# Altium schematic sheet Control.SchDoc
size B; DocumentNumber: 5; SheetNumber: 5; SheetTotal: 13
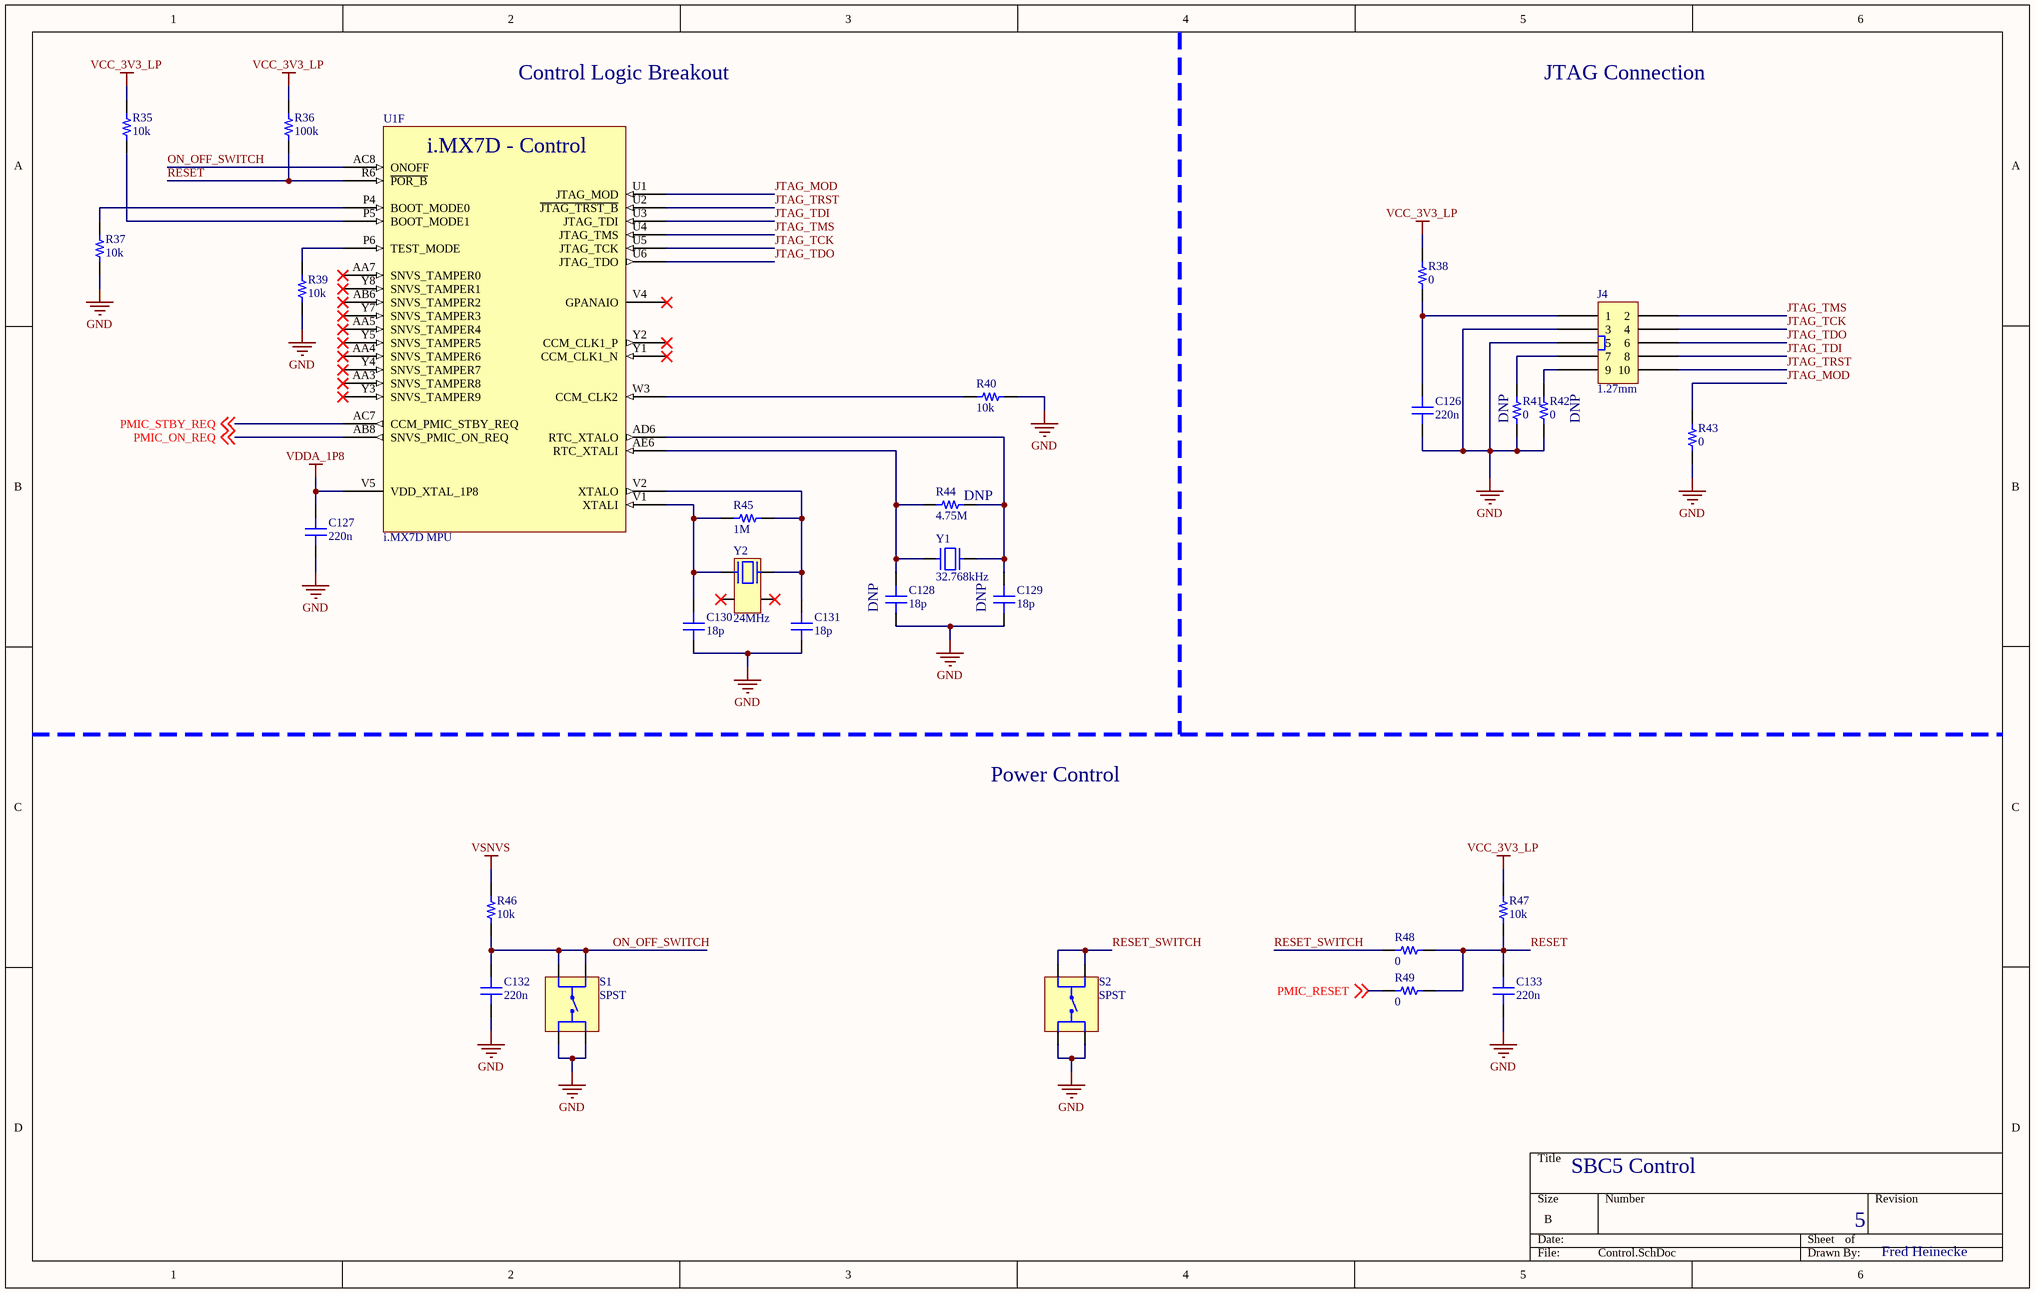
[diagram p0: Control.SchDoc]

## Parts
C126  220n  [C0201]
C127  220n  [C0201]
C128  18p  [C0402]
C129  18p  [C0402]
C130  18p  [C0402]
C131  18p  [C0402]
C132  220n  [C0201]
C133  220n  [C0201]
J4  1.27mm  [20021521-00010T1LF]
R35  10k  [R0201]
R36  100k  [R0201]
R37  10k  [R0201]
R38  0  [R1210]
R39  10k  [R0201]
R40  10k  [R0201]
R41  0  [R0402]
R42  0  [R0402]
R43  0  [R0402]
R44  4.75M  [R0402]
R45  1M  [R0402]
R46  10k  [R0201]
R47  10k  [R0201]
R48  0  [R0402]
R49  0  [R0402]
S1  SPST  [1825910-7]
S2  SPST  [1825910-7]
U1  i.MX7D MPU  [BGA541C75P25X25_1900X1900X140]  (part F of 23)
Y1  32.768kHz  [CM7V-T1A]
Y2  24MHz  [FQ5032B]

## Nets
GND: C126.1 C127.1 C128.1 C129.1 C130.1 C131.1 C132.1 C133.1 J4.3 J4.5 R37.1 R39.1 R40.2 R41.1 R42.1 R43.1 S1.3 S1.4 S2.3 S2.4
VCC_3V3_LP: R35.2 R36.2 R38.2 R47.2
VDDA_1P8: C127.2 U1.V5(VDD_XTAL_1P8)
VSNVS: R46.2
JTAG_MOD: R43.2 U1.U1(JTAG_MOD)
JTAG_TCK: J4.4 U1.U5(JTAG_TCK)
JTAG_TDI: J4.8 U1.U3(JTAG_TDI)
JTAG_TDO: J4.6 U1.U6(JTAG_TDO)
JTAG_TMS: J4.2 U1.U4(JTAG_TMS)
JTAG_TRST: J4.10 U1.U2(~{JTAG_TRST_B})
ON_OFF_SWITCH: C132.2 R46.1 S1.1 S1.2 U1.AC8(ONOFF)
PMIC_ON_REQ: U1.AB8(SNVS_PMIC_ON_REQ) ; off-sheet PMIC_ON_REQ
PMIC_RESET: R49.1 ; off-sheet PMIC_RESET
PMIC_STBY_REQ: U1.AC7(CCM_PMIC_STBY_REQ) ; off-sheet PMIC_STBY_REQ
RESET: C133.2 R36.1 R47.1 R48.2 R49.2 U1.R6(~{POR_B})
RESET_SWITCH: R48.1 S2.1 S2.2
NetC126_2: C126.2 J4.1 R38.1
NetC128_2: C128.2 R44.1 U1.AE6(RTC_XTALI) Y1.1
NetC129_2: C129.2 R44.2 U1.AD6(RTC_XTALO) Y1.2
NetC130_2: C130.2 R45.1 U1.V1(XTALI) Y2.1
NetC131_2: C131.2 R45.2 U1.V2(XTALO) Y2.3
NetJ4_7: J4.7 R41.2
NetJ4_9: J4.9 R42.2
NetR35_1: R35.1 U1.P5(BOOT_MODE1)
NetR37_2: R37.2 U1.P4(BOOT_MODE0)
NetR39_2: R39.2 U1.P6(TEST_MODE)
NetR40_1: R40.1 U1.W3(CCM_CLK2)

Not connected (* = marked no-connect by the designer): U1 AA3(SNVS_TAMPER8)* AA4(SNVS_TAMPER6)* AA5(SNVS_TAMPER4)* AA7(SNVS_TAMPER0)* AB6(SNVS_TAMPER2)* V4(GPANAIO)* Y1(CCM_CLK1_N)* Y2(CCM_CLK1_P)* Y3(SNVS_TAMPER9)* Y4(SNVS_TAMPER7)* Y5(SNVS_TAMPER5)* Y7(SNVS_TAMPER3)* Y8(SNVS_TAMPER1)*; Y2 2* 4*

## Notes on the sheet
- Control Logic Breakout
- JTAG Connection
- (near R41) DNP
- DNP
- (near R44) DNP
- (near C128) DNP
- (near C129) DNP
- Power Control
- SBC5 Control
- 5
- Fred Heinecke
- (in symbol MCIMX7D2DVM12SD, part F) i.MX7D - Control

## Library data of the parts
C126 C127 C132 C133 = GRM033R61C224KE14D: Cap Ceramic Monolithic 0.22uF 16VDC 10% SMD Paper T/R; Manufacturer: Murata; Supplier 1: Digi-Key; Manufacturer Part Number: GRM033R61C224KE14D; RoHS: No; Stock 1: 16192; Pricing 1: 1=0.10000, 10=0.03900, 50=0.02120, 100=0.01720, 500=0.01232, 1000=0.00968, 2500=0.00880, 5000=0.00810 (USD); ComponentLink1URL: https://search.murata.co.jp/Ceramy/image/img/A01X/G101/ENG/GRM033R61C224KE14-01.pdf?src-supplier=Digi-Key; ComponentLink1Description: https://search.murata.co.jp/Ceramy/image/img/A01X/G101/ENG/GRM033R61C224KE14-01.pdf?src-supplier=Digi-Key; Supplier Part Number 1: 490-17040-1-ND
C128-C131 = CL05C180JB5NNNC: CAP CER 18PF 50V C0G/NP0 0402; Manufacturer: Samsung; Material: Ceramic; Dielectric: C0G; Tolerance: 5%; Temperature Coefficient: 300ppm/°C; Supplier 1: Digi-Key; Supplier Part Number 1: 1276-1140-1-ND; Manufacturer Part Number: CL05C180JB5NNNC; RoHS: Yes; Category: Ceramic Capacitors; Stock 1: 647155; Pricing 1: 1=0.10000, 10=0.03600, 50=0.01940, 100=0.01590, 500=0.01136, 1000=0.00892, 2500=0.00811, 5000=0.00746 (USD); Mount: Surface Mount; Case/Package: 0402; Case Code (Imperial): 0402; Case Code (Metric): 1005; Contact Plating: Tin; Min Operating Temperature: -55°C; Max Operating Temperature: 125°C; Capacitance: 18pF; Voltage: 50V; Package Quantity: 1; Packaging: Tape and Reel; Voltage Rating: 50V; Length: 1mm; Width: 0.02inch; Height: 0.5mm; Thickness: 0.022inch; Depth: 0.5mm; Radiation Hardening: No; ComponentLink1URL: https://datasheet.ciiva.com/15195/getdatasheetpartid-482699-15195673.pdf?src-supplier=Verical; ComponentLink1Description: https://datasheet.ciiva.com/15195/getdatasheetpartid-482699-15195673.pdf?src-supplier=Verical; ComponentLink2URL: https://datasheet.ciiva.com/29198/458675-da-01-en-vs-kondensator-0402-29198417.pdf?src-supplier=Conrad; ComponentLink2Description: https://datasheet.ciiva.com/29198/458675-da-01-en-vs-kondensator-0402-29198417.pdf?src-supplier=Conrad; ComponentLink3URL: https://datasheet.ciiva.com/26309/mlcc-catalogdownload2013-eng-26309006.pdf?src-supplier=Distrelec; ComponentLink3Description: https://datasheet.ciiva.com/26309/mlcc-catalogdownload2013-eng-26309006.pdf?src-supplier=Distrelec
J4 = 20021521-00010T1LF: CONN HEADER SMD 10POS 1.27MM; Manufacturer: Amphenol FCI; Number of Positions: 10; Connector Type: Male Pin; Current Rating: 1A; Voltage Rating: 125V; Contact Resistance: 30mR; Gender: Male; Row Spacing: 0.05inch; Supplier 1: Digi-Key; Supplier Part Number 1: 609-4054-ND; Manufacturer Part Number: 20021521-00010T1LF; RoHS: Yes; Category: Headers and Wire Housings; Stock 1: 5644; Pricing 1: 1=1.26000, 10=1.10500, 100=0.95300, 500=0.77976, 1000=0.69312, 5000=0.60648, 10000=0.57616 (USD); Mount: Surface Mount; Contact Plating: Gold; Contact Material: Copper Alloy; Color: Black; Housing Color: Black; Housing Material: Plastic; Min Operating Temperature: -40°C; Max Operating Temperature: 85°C; Number of Rows: 2; Termination: SMD/SMT; Packaging: Rail/Tube; Number of Contacts: 10; Package Quantity: 22; Max Voltage Rating (AC): 125V; Orientation: Straight; Series: Minitek; Length: 10.11mm; Pitch: 1.27mm; Depth: 5.1mm; REACH SVHC: No SVHC; Lead Free: Lead Free; RoHS Compliant: Yes; ComponentLink1URL: https://datasheet.ciiva.com/26900/getdatasheetpartid-733986-26900911.pdf?src-supplier=Verical; ComponentLink1Description: https://datasheet.ciiva.com/26900/getdatasheetpartid-733986-26900911.pdf?src-supplier=Verical; ComponentLink2URL: https://datasheet.ciiva.com/10140/20021521-10140598.pdf?src-supplier=Avnet; ComponentLink2Description: https://datasheet.ciiva.com/10140/20021521-10140598.pdf?src-supplier=Avnet; ComponentLink3URL: https://datasheet.ciiva.com/17011/70277217-17011530.pdf?src-supplier=Allied+Electronics; ComponentLink3Description: https://datasheet.ciiva.com/17011/70277217-17011530.pdf?src-supplier=Allied+Electronics; ComponentLink4URL: https://datasheet.ciiva.com/16691/20021521-16691102.pdf?src-supplier=Avnet+Europe; ComponentLink4Description: https://datasheet.ciiva.com/16691/20021521-16691102.pdf?src-supplier=Avnet+Europe
R35 R37 R39 R40 R46 R47 = RMCF0201FT10K0: RES 10K OHM 1% 1/20W 0201; Manufacturer: Stackpole Electronics; Max Power Dissipation: 50mW; Temperature Coefficient: 200ppm/°C; Resistance: 10kR; Supplier 1: Digi-Key; Manufacturer Part Number: RMCF0201FT10K0; RoHS: Yes; Category: Chip SMD Resistors; Stock 1: 1526173; Pricing 1: 1=0.10000, 10=0.02300, 100=0.00940, 1000=0.00424, 2500=0.00368, 5000=0.00304 (USD); Mount: Surface Mount; Case/Package: 0201; Contact Plating: Tin,Matte; Case Code (Imperial): 0201; Case Code (Metric): 0603; Min Operating Temperature: -55°C; Max Operating Temperature: 125°C; Resistor Type: Thick Film; Number of Terminations: 2; Packaging: Tape and Reel; Tolerance: 1%; Power Rating: 50mW; Length: 0.024inch; Width: 0.012inch; Height: 0.009inch; ComponentLink1URL: https://www.seielect.com/catalog/SEI-Packaging.pdf?src-supplier=Digi-Key; ComponentLink1Description: https://www.seielect.com/catalog/SEI-Packaging.pdf?src-supplier=Digi-Key; ComponentLink2URL: https://www.seielect.com/Catalog/SEI-RMCF_RMCP.pdf?src-supplier=Avnet+Asia; ComponentLink2Description: https://www.seielect.com/Catalog/SEI-RMCF_RMCP.pdf?src-supplier=Avnet+Asia; ComponentLink3URL: https://www.seielect.com/Catalog/SEI-RMCF_RMCP.pdf?src-supplier=Avnet; ComponentLink3Description: https://www.seielect.com/Catalog/SEI-RMCF_RMCP.pdf?src-supplier=Avnet; ComponentLink4URL: https://www.seielect.com/Catalog/SEI-RMCF_RMCP.pdf?src-supplier=Digi-Key; ComponentLink4Description: https://www.seielect.com/Catalog/SEI-RMCF_RMCP.pdf?src-supplier=Digi-Key; Supplier Part Number 1: RMCF0201FT10K0CT-ND
R36 = ERJ-1GNF1003C: PANASONIC - ERJ1GNF1003C - RES, 100K, 1%, 0.05W, 0201, THICK FILM; Resistance: 100kR; Temperature Coefficient: 200ppm/°C; Power Rating: 50mW; Voltage Rating: 25V; Supplier 1: Digi-Key; Supplier Part Number 1: P122655CT-ND; Manufacturer: Panasonic; Manufacturer Part Number: ERJ-1GNF1003C; RoHS: Yes; Category: Chip SMD Resistors; Stock 1: 833904; Pricing 1: 1=0.10000, 10=0.04600, 100=0.01890, 1000=0.00848, 2500=0.00736, 5000=0.00608 (USD); Mount: Surface Mount; Case/Package: 0201; Number of Pins: 2; Contact Plating: Tin,Matte; Case Code (Metric): 0603; Case Code (Imperial): 0201; Weight: 6E-06oz; Size Code: 0201; Min Operating Temperature: -55°C; Max Operating Temperature: 125°C; Tolerance: 1%; Resistor Type: Thick Film; Packaging: Tape and Reel; Package Quantity: 15000; Number of Terminations: 2; Max Power Dissipation: 50mW; Termination: SMD/SMT; Voltage Rating (DC): 25V; Series: ERJ; Resistance Tolerance: 1%; Length: 0.024inch; Width: 0.012inch; Height: 0.01inch; Radiation Hardening: No; REACH SVHC: No SVHC; Lead Free: Lead Free; RoHS Compliant: Yes; ComponentLink1URL: https://datasheet.ciiva.com/7830/1678782-7830709.pdf?src-supplier=Element14; ComponentLink1Description: https://datasheet.ciiva.com/7830/1678782-7830709.pdf?src-supplier=Element14; ComponentLink2URL: https://datasheet.ciiva.com/16508/aoa0000ce2-16508328.pdf?src-supplier=Future+Electronics; ComponentLink2Description: https://datasheet.ciiva.com/16508/aoa0000ce2-16508328.pdf?src-supplier=Future+Electronics; ComponentLink3URL: https://datasheet.ciiva.com/24161/aoa0000ce2-24161032.pdf?src-supplier=Mouser; ComponentLink3Description: https://datasheet.ciiva.com/24161/aoa0000ce2-24161032.pdf?src-supplier=Mouser; ComponentLink4URL: https://datasheet.ciiva.com/43467/1678782-43467102.pdf?src-supplier=Farnell; ComponentLink4Description: https://datasheet.ciiva.com/43467/1678782-43467102.pdf?src-supplier=Farnell
R38 = RMCF1210ZT0R00: RES 0.0 OHM 1/2W 1210 SMD; Manufacturer: Stackpole Electronics; Resistance: 0mR; Power Rating: 330mW; Max Power Dissipation: 500mW; Tolerance: 1%; Supplier 1: Digi-Key; Supplier Part Number 1: RMCF1210ZT0R00CT-ND; Manufacturer Part Number: RMCF1210ZT0R00; RoHS: Yes; Category: Chip SMD Resistors; Stock 1: 487458; Pricing 1: 1=0.10000, 10=0.09100, 25=0.06320, 50=0.04900, 100=0.03500, 250=0.02732, 500=0.02170, 1000=0.01540 (USD); Mount: Surface Mount; Case/Package: 1210; Case Code (Metric): 3225; Contact Plating: Tin,Matte; Case Code (Imperial): 1210; Min Operating Temperature: -55°C; Max Operating Temperature: 155°C; Packaging: Tape and Reel; Resistor Type: Thick Film; Number of Terminations: 2; Features: Automotive AEC-Q200; Length: 0.126inch; Width: 0.098inch; Height: 0.028inch; Radiation Hardening: No; Lead Free: Lead Free; ComponentLink1URL: https://www.seielect.com/Catalog/SEI-RMCF_RMCP.pdf?src-supplier=Digi-Key; ComponentLink1Description: https://www.seielect.com/Catalog/SEI-RMCF_RMCP.pdf?src-supplier=Digi-Key; ComponentLink2URL: https://www.seielect.com/catalog/SEI-RMCF_RMCP.pdf?src-supplier=Avnet; ComponentLink2Description: https://www.seielect.com/catalog/SEI-RMCF_RMCP.pdf?src-supplier=Avnet
R41-R43 R48 R49 = RMCF0402ZT0R00: RES 0 OHM JUMPER 1/16W 0402; Manufacturer: Stackpole Electronics; Resistance: 0R; Power Rating: 63mW; Current Rating: 1A; Working Voltage: 50V; Supplier 1: Digi-Key; Supplier Part Number 1: RMCF0402ZT0R00CT-ND; Manufacturer Part Number: RMCF0402ZT0R00; RoHS: Yes; Category: Chip SMD Resistors; Stock 1: 7645981; Pricing 1: 1=0.10000, 10=0.01000, 25=0.00720, 50=0.00560, 100=0.00410, 250=0.00316, 500=0.00252, 1000=0.00186, 5000=0.00133 (USD); Mount: Surface Mount; Case/Package: 0402; Case Code (Metric): 1005; Case Code (Imperial): 0402; Contact Plating: Tin,Matte; Min Operating Temperature: -55°C; Max Operating Temperature: 155°C; Packaging: Tape and Reel; Resistor Type: Thick Film; Number of Terminations: 2; Max Power Dissipation: 63mW; Features: Automotive AEC-Q200; Series: RMCF; Technology: THICK FILM; Construction: Rectangular; Length: 0.039inch; Width: 0.02inch; Height: 0.016inch; Depth: 0.5mm; Radiation Hardening: No; Military Standard: Not; Lead Free: Lead Free; RoHS Compliant: Yes; ComponentLink1URL: https://datasheet.ciiva.com/26835/getdatasheetpartid-409751-26835612.pdf?src-supplier=Verical; ComponentLink1Description: https://datasheet.ciiva.com/26835/getdatasheetpartid-409751-26835612.pdf?src-supplier=Verical
R44 = RC0402FR-074M75L: Thick Film Resistors - SMD 4.75M OHM 1%; Manufacturer: Yageo; Resistance: 4.75MR; Temperature Coefficient: 100ppm/°C; Power Rating: 62.5mW; Voltage Rating: 50V; Max Power Dissipation: 63mW; Supplier 1: Digi-Key; Supplier Part Number 1: 13-RC0402FR-074M75LCT-ND; Manufacturer Part Number: RC0402FR-074M75L; RoHS: Yes; Category: Chip SMD Resistors; Stock 1: 19791; Pricing 1: 1=0.10000, 10=0.01400, 100=0.00580, 1000=0.00260, 2500=0.00226, 5000=0.00186 (USD); Case/Package: 0402; Contact Plating: Tin,Matte; Case Code (Imperial): 0402; Case Code (Metric): 1005; Min Operating Temperature: -55°C; Max Operating Temperature: 155°C; Tolerance: 1%; Resistor Type: Thick Film; Packaging: Tape and Reel; Number of Terminations: 2; Termination: SMD/SMT; Features: Moisture Resistant; Series: RC; Length: 0.039inch; Width: 0.02inch; Height: 0.016inch; RoHS Compliant: Yes; ComponentLink1URL: https://datasheet.ciiva.com/28409/pyu-rc0402-51-rohs-l-6-28409879.pdf?src-supplier=Avnet+Europe; ComponentLink1Description: https://datasheet.ciiva.com/28409/pyu-rc0402-51-rohs-l-6-28409879.pdf?src-supplier=Avnet+Europe; ComponentLink2URL: https://datasheet.ciiva.com/16867/pyu-rc0402-51-rohs-l-6-16867754.pdf?src-supplier=Avnet+Europe; ComponentLink2Description: https://datasheet.ciiva.com/16867/pyu-rc0402-51-rohs-l-6-16867754.pdf?src-supplier=Avnet+Europe; ComponentLink3URL: https://datasheet.ciiva.com/12560/pyu-rc0402-51-rohs-l-6-r-8721-12560812.pdf?src-supplier=Mouser; ComponentLink3Description: https://datasheet.ciiva.com/12560/pyu-rc0402-51-rohs-l-6-r-8721-12560812.pdf?src-supplier=Mouser; ComponentLink4URL: https://datasheet.ciiva.com/8892/pyu-rc0402-51-rohs-l-6-8892877.pdf?src-supplier=Avnet; ComponentLink4Description: https://datasheet.ciiva.com/8892/pyu-rc0402-51-rohs-l-6-8892877.pdf?src-supplier=Avnet
R45 = RC0402FR-071ML: RES SMD 1M OHM 1% 1/16W 0402; Manufacturer: Yageo; Resistance: 1MR; Power Rating: 63mW; Voltage Rating: 50V; Temperature Coefficient: 100ppm/°C; Supplier 1: Arrow Electronics; Supplier Part Number 1: RC0402FR-071ML; Manufacturer Part Number: RC0402FR-071ML; RoHS: Yes; Category: Chip SMD Resistors; Stock 1: 2720000; Pricing 1: 1=0.092200, 10=0.011400, 25=0.009100, 100=0.003800, 250=0.003700, 500=0.003100, 1000=0.002300, 3000=0.002000, 10000=0.001300, 30000=0.001300, 50000=0.001200 (USD); Case/Package: 0402; Case Code (Imperial): 0402; Case Code (Metric): 1005; Size Code: 0402; Min Operating Temperature: -55°C; Max Operating Temperature: 155°C; Resistor Type: Thick Film; Packaging: Tape and Reel; Tolerance: 1%; Termination: SMD/SMT; Features: Moisture Resistant; Series: RC; Max Power Dissipation: 63mW; Number of Terminations: 2; Resistance Tolerance: 1%; Construction: Rectangular; Technology: THICK FILM; Length: 1mm; Height: 0.32mm; Depth: 0.5mm; RoHS Compliant: Yes; REACH SVHC: Unknown; Military Standard: Not; Lead Free: Lead Free; ComponentLink1URL: https://datasheet.ciiva.com/11808/0900766b80c66297-11808125.pdf?src-supplier=RSComponents; ComponentLink1Description: https://datasheet.ciiva.com/11808/0900766b80c66297-11808125.pdf?src-supplier=RSComponents; ComponentLink2URL: https://datasheet.ciiva.com/46394/1018594-46394951.pdf?src-supplier=Element14; ComponentLink2Description: https://datasheet.ciiva.com/46394/1018594-46394951.pdf?src-supplier=Element14; ComponentLink3URL: https://datasheet.ciiva.com/7849/1018594-7849883.pdf?src-supplier=Element14; ComponentLink3Description: https://datasheet.ciiva.com/7849/1018594-7849883.pdf?src-supplier=Element14; ComponentLink4URL: https://datasheet.ciiva.com/16741/pyu-rc0402-51-rohs-l-6-r-16741081.pdf?src-supplier=Future+Electronics; ComponentLink4Description: https://datasheet.ciiva.com/16741/pyu-rc0402-51-rohs-l-6-r-16741081.pdf?src-supplier=Future+Electronics; ComponentLink5URL: https://datasheet.ciiva.com/7849/1018594-7849882.pdf?src-supplier=Element14; ComponentLink5Description: https://datasheet.ciiva.com/7849/1018594-7849882.pdf?src-supplier=Element14
S1 S2 = 1825910-7: TE CONNECTIVITY / ALCOSWITCH         1825910-7             Tactile Switch, Non Illuminated, 24 V, 50 mA, 260 gf, Through Hole; Mechanical Life: 100000Cycles; Actuator Material: PBT; Actuator Color: Red; Operating Force: 2.55N; Max Voltage Rating (DC): 24V; Illumination Type: Non-Illuminated,Illuminated; Contact Resistance: 100mR; Contact Current Rating: 50mA; Switch Travel: 0.25mm; Switch Function: Off-Mom; Actuator Type: Standard; Actuator Length: 0.055inch; Supplier 1: Digi-Key; Supplier Part Number 1: 450-1804-ND; Manufacturer: TE Connectivity; Manufacturer Part Number: 1825910-7; RoHS: Yes; Category: Pushbutton Switches; Stock 1: 14477; Pricing 1: 1=0.11000, 10=0.10600, 25=0.10080, 100=0.09160, 250=0.08612, 500=0.07878, 1000=0.06595, 5000=0.06046, 10000=0.05679 (USD); Mount: Through Hole; Contact Material: Copper Alloy; Contact Plating: Silver; Min Operating Temperature: -35°C; Max Operating Temperature: 85°C; Throw Configuration: SPST; Termination: PC Pins; Packaging: Loose Piece; Package Quantity: 750; Type: Switch; Voltage Rating (DC): 24V; Electrical Life: 100000Cycles; Orientation: Straight; Series: FSMJ; Max Current Rating: 50mA; Length: 5.99mm; Depth: 7.8mm; Radiation Hardening: No; RoHS Compliant: Yes; REACH SVHC: Unknown; ELV: Compliant; Lead Free: Lead Free; ComponentLink1URL: https://datasheet.ciiva.com/30117/17-30117153.pdf?src-supplier=Onlinecomponents.com; ComponentLink1Description: https://datasheet.ciiva.com/30117/17-30117153.pdf?src-supplier=Onlinecomponents.com; ComponentLink2URL: https://datasheet.ciiva.com/16312/1825910-7-16312610.pdf?src-supplier=Future+Electronics; ComponentLink2Description: https://datasheet.ciiva.com/16312/1825910-7-16312610.pdf?src-supplier=Future+Electronics; ComponentLink3URL: https://datasheet.ciiva.com/16987/0900766b808a3755-16987820.pdf?src-supplier=Allied+Electronics; ComponentLink3Description: https://datasheet.ciiva.com/16987/0900766b808a3755-16987820.pdf?src-supplier=Allied+Electronics
U1 = MCIMX7D2DVM12SD: Heterogeneous Multicore Processing Architecture; Manufacturer: NXP Freescale; Manufacturer Part Number: MCIMX7D2DVM12SD; Stock 1: 0; Pricing 1: 168=18.42238 (USD); ComponentLink1Description: Datasheet; ComponentLink1URL: https://www.nxp.com/docs/en/data-sheet/IMX7DCEC.pdf; ComponentLink2Description: Reference manual; ComponentLink2URL: https://www.nxp.com/docs/en/reference-manual/IMX7DRM.pdf; ComponentLink3Description: Hardware Development Guide; ComponentLink3URL: https://www.nxp.com/docs/en/user-guide/IMX7DSHDG.pdf; Supplier 1: Digi-Key; Supplier Part Number 1: 568-15401-ND
Y1 = CM7VT1A-LOWESR-32.768KHZ-12.5PF-20-TA-QC: 32.768 kHz crystal oscillator, 12.5 pF 50k ESR; Manufacturer: Micro Crystal; Supplier 1: Digi-Key; Supplier Part Number 1: 2195-CM7VT1ALOWESR32.768KHZ12.5PF20TAQCCT-ND; Manufacturer Part Number: CM7VT1A-LOWESR-32.768KHZ-12.5PF-20-TA-QC; RoHS: No; Stock 1: 2790; Pricing 1: 1=0.47000, 10=0.39400, 50=0.35440, 100=0.31500, 500=0.29924 (USD)
Y2 = FC5BQCCMC24.0-T1: Crystal 24MHz ±30ppm (Tol) ±30ppm (Stability) 20pF FUND 50Ohm 4-Pin SMD T/R; Manufacturer: Fox Electronics; ESR (Equivalent Series Resistance): 50R; Supplier 1: Digi-Key; Supplier Part Number 1: 631-1026-1-ND; Manufacturer Part Number: FC5BQCCMC24.0-T1; RoHS: Yes; Stock 1: 5766; Pricing 1: 1=0.77000, 10=0.64300, 50=0.57880, 100=0.51450, 500=0.48878 (USD); Mount: Surface Mount; Case/Package: SMD/SMT; Min Operating Temperature: 0°C; Max Operating Temperature: 70°C; Packaging: Tape and Reel; Frequency: 24MHz; Frequency Stability: 30ppm; Frequency Tolerance: 30ppm; Load Capacitance: 20pF; ComponentLink1URL: http://www.foxonline.com/pdfs/C5BQ.pdf?src-supplier=Digi-Key; ComponentLink1Description: http://www.foxonline.com/pdfs/C5BQ.pdf?src-supplier=Digi-Key